# EAGLE design test (EAGLE 7.5.0)
ESKD_CHECKED: 209|224|244|232|243|235|235|232|237|32|205|46|210; ESKD_CONTROLN: 202|238|247|234|232|237|224|32|194|46|212; ESKD_COPYRIGHT: 211|240|212|211|44|32|200|208|200|210|45|208|210|212|44|32|208|199|45|54|48|48|52|48|55; ESKD_DATE1: 50|53|46|48|53|46|50|48|49|54; ESKD_DESCRIPTION1: 192|239|239|224|240|224|242|237|238|45|239|240|238|227|240|224|236|236|237|251|233|32|234|238|236|239|235|229|234|241|32|228|235|255|32|238|239|229|240|224|242|232|226|237|238|227|238|32|236|238|237|232|242|238|240|232|237|227|224|32|234|224|247|229|241|242|226|224|32|226|238|231|228|243|245|224|32|226|32|230|232|235|251|245|32|239|238|236|229|249|229|237|232|255|245; ESKD_DESCRIPTION2: 241|245|229|236|224|32|253|235|229|234|242|240|232|247|229|241|234|224|255; ESKD_DESCRIPTION3: 239|240|232|237|246|232|239|232|224|235|252|237|224|255; ESKD_ENGINEER: 208|238|227|238|230|232|237|32|194|46|200|46; ESKD_NUMBER: 50|51|48|50|48|49|32|48|48|48|32|48|48|48|32|55|49|55; ESKD_ORIENTATION: 48; ESKD_PAPER_SIZE: 49; ESKD_SHEETS: 49
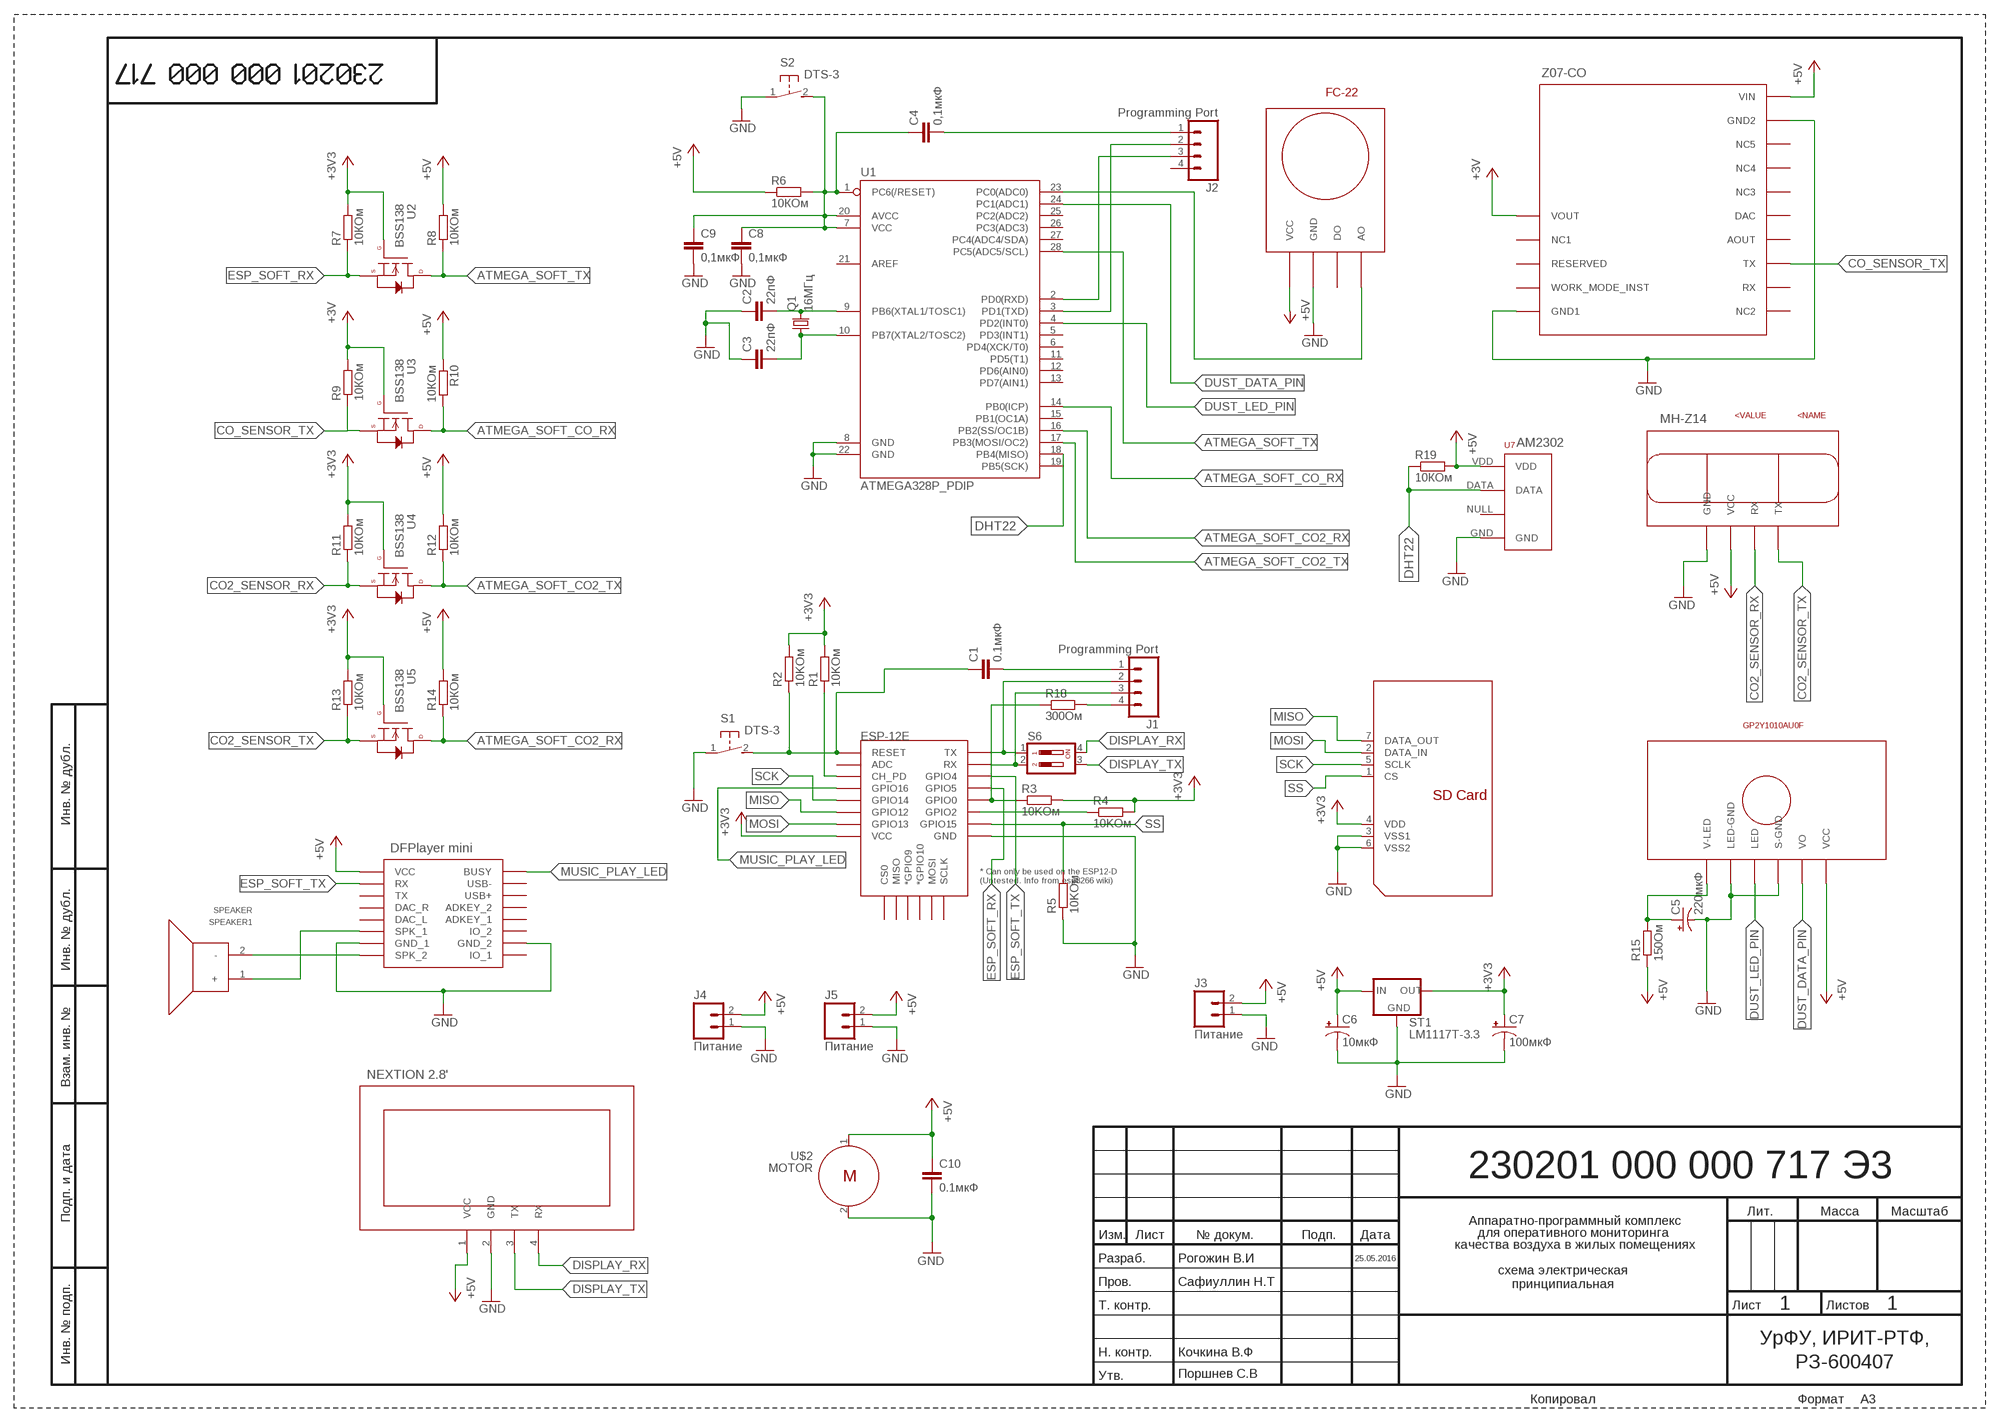
[diagram p0: schematic, sheet 1]

## Parts
C1  0.1мкФ  0.1UF-50V-20%(PTH)KIT-EZ  [CAP-PTH-SMALL-KIT]
C2  22пФ  0.1UF-50V-20%(PTH)KIT-EZ  [CAP-PTH-SMALL-KIT]
C3  22пФ  0.1UF-50V-20%(PTH)KIT-EZ  [CAP-PTH-SMALL-KIT]
C4  0,1мкФ  0.1UF-50V-20%(PTH)KIT-EZ  [CAP-PTH-SMALL-KIT]
C5  220мкФ  10UF-25V-20%(PTH)KIT  [CPOL-RADIAL-10UF-25V-KIT]
C6  10мкФ  10UF-25V-20%(PTH)KIT  [CPOL-RADIAL-10UF-25V-KIT]
C7  100мкФ  10UF-25V-20%(PTH)KIT  [CPOL-RADIAL-10UF-25V-KIT]
C8  0,1мкФ  0.1UF-50V-20%(PTH)KIT-EZ  [CAP-PTH-SMALL-KIT]
C9  0,1мкФ  0.1UF-50V-20%(PTH)KIT-EZ  [CAP-PTH-SMALL-KIT]
C10  0.1мкФ  0.1UF-50V-20%(PTH)KIT-EZ  [CAP-PTH-SMALL-KIT]
ESP-12E  ESP12ESMD  [ESP12E-SMD]
FC-22  FC-22FC-22-STANDART  [FC-22]
GP2Y1010AU0F  GP2Y1010AU0FGP2Y1010AU0F  [1X06]
J1  Programming Port  M04PTH  [1X04]
J2  Programming Port  M04PTH  [1X04]
J3  Питание  M02PTH  [1X02]
J4  Питание  M02PTH  [1X02]
J5  Питание  M02PTH  [1X02]
MH-Z14  MH-Z14  [1X04]
NEXTION1  NEXTION  [1X04]
Q1  16МГц  CRYSTALHC49S  [HC49/S]
R1  10KОм  R-EU_0207/10  [0207/10]
R2  10KОм  R-EU_0207/10  [0207/10]
R3  10KОм  R-EU_0207/10  [0207/10]
R4  10KОм  R-EU_0207/10  [0207/10]
R5  10KОм  R-EU_0207/10  [0207/10]
R6  10КОм  R-EU_0207/10  [0207/10]
R7  10КОм  R-EU_0207/10  [0207/10]
R8  10КОм  R-EU_0207/10  [0207/10]
R9  10КОм  R-EU_0207/10  [0207/10]
R10  10КОм  R-EU_0207/10  [0207/10]
R11  10КОм  R-EU_0207/10  [0207/10]
R12  10КОм  R-EU_0207/10  [0207/10]
R13  10КОм  R-EU_0207/10  [0207/10]
R14  10КОм  R-EU_0207/10  [0207/10]
R15  150Ом  R-EU_0207/10  [0207/10]
R18  300Ом  R-EU_0207/10  [0207/10]
R19  10КОм  R-EU_0207/10  [0207/10]
S1  DTS-3  [DTS-3]
S2  DTS-3  [DTS-3]
S6  DS02  [DS-02]
SDCARD-1  SDCARDSDSTAY  [SD]
SPEAKER1  SPEAKER  [1X02]
ST1  LM1117T-3.3  V_REG_LD1117VXX  [78XXL]
U1  ATMEGA328P_PDIP  [DIL28-3]
U2  BSS138  N-CHANNEL-MOSFET-BSS138  [SOT23-3]
U3  BSS138  N-CHANNEL-MOSFET-BSS138  [SOT23-3]
U4  BSS138  N-CHANNEL-MOSFET-BSS138  [SOT23-3]
U5  BSS138  N-CHANNEL-MOSFET-BSS138  [SOT23-3]
U7  RHT03_DHT-22_AM2302  [RHT03_DHT-22]
U$1  DFPLAYER  [DFPLAYER]
U$2  MOTOR  [1X02]
Z07-CO-1  ZE07-CO  [Z07-CO]

## Nets
+3V3: C7.1(+) ESP-12E.VCC R1.2 R2.2 R3.2 R4.2 R7.2 R11.2 R13.2 ST1.GND(OUT) U2.1(G) U4.1(G) U5.1(G)
+5V: C6.1(+) C10.1 FC-22.1(VCC) GP2Y1010AU0F.6(VCC) J3.2 J4.2 J5.2 MH-Z14.3(VCC) NEXTION1.1(VCC) R6.1 R8.2 R10.1 R12.2 R14.2 R15.1 R19.2 ST1.OUT(IN) U7.VDD U$1.VCC U$2.1 Z07-CO-1.15(VIN)
ATMEGA_SOFT_CO2_RX: R14.1 U1.16(PB2(SS/OC1B)) U5.3(D)
ATMEGA_SOFT_CO2_TX: R12.1 U1.17(PB3(MOSI/OC2)) U4.3(D)
ATMEGA_SOFT_CO_RX: R10.2 U1.14(PB0(ICP)) U3.3(D)
ATMEGA_SOFT_TX: R8.1 U1.28(PC5(ADC5/SCL)) U2.3(D)
CO2_SENSOR_RX: MH-Z14.2(RX) R11.1 U4.2(S)
CO2_SENSOR_TX: MH-Z14.1(TX) R13.1 U5.2(S)
CO_SENSOR_TX: R9.1 U3.2(S) Z07-CO-1.8(TX)
DHT22: R19.1 U1.18(PB4(MISO)) U7.DATA
DISPLAY_RX: NEXTION1.4(RX) S6.4
DISPLAY_TX: NEXTION1.3(TX) S6.3
DUST_DATA_PIN: GP2Y1010AU0F.5(VO) U1.24(PC1(ADC1))
DUST_LED_PIN: GP2Y1010AU0F.3(LED) U1.4(PD2(INT0))
ESP_SOFT_RX: ESP-12E.GPIO5 R7.1 U2.2(S)
ESP_SOFT_TX: ESP-12E.GPIO4 U$1.RX
GND: C2.1 C3.1 C5.2(-) C6.2(-) C7.2(-) C8.2 C9.2 C10.2 ESP-12E.GND FC-22.2(GND) GP2Y1010AU0F.2(LED-GND) GP2Y1010AU0F.4(S-GND) J3.1 J4.1 J5.1 MH-Z14.4(GND) NEXTION1.2(GND) R5.1 S1.1 S2.1 ST1.IN(GND) U1.8(GND) U1.22(GND) U7.GND U$1.GND_1 U$1.GND_2 U$2.2 Z07-CO-1.5(GND1) Z07-CO-1.14(GND2)
MISO: ESP-12E.GPIO12 SDCARD-1.7(DATA_OUT)
MOSI: ESP-12E.GPIO13 SDCARD-1.2(DATA_IN)
MUSIC_PLAY_LED: ESP-12E.GPIO16 U$1.BUSY
N$1: C5.1(+) GP2Y1010AU0F.1(V-LED) R15.2
N$2: C4.1 C8.1 C9.1 R6.2 S2.2 U1.1(PC6(/RESET)) U1.7(VCC) U1.20(AVCC)
N$3: ESP-12E.CH_PD R1.1
N$4: ESP-12E.GPIO0 R3.1 R18.1
N$5: ESP-12E.GPIO2 R4.1
N$6: ESP-12E.RXD0(RX) J1.3 S6.2
N$7: C1.1 ESP-12E.RESET R2.1 S1.2
N$8: C1.2 J1.1
N$9: ESP-12E.TXD0(TX) J1.2 S6.1
N$10: C3.2 Q1.1 U1.10(PB7(XTAL2/TOSC2))
N$11: SPEAKER1.1(+) U$1.SPK1(SPK_1)
N$12: SPEAKER1.2(-) U$1.SPK2(SPK_2)
N$13: C2.2 Q1.2 U1.9(PB6(XTAL1/TOSC1))
N$14: C4.2 J2.1
N$15: J2.2 U1.3(PD1(TXD))
N$16: J1.4 R18.2
N$17: J2.3 U1.2(PD0(RXD))
N$18: FC-22.4(AO) U1.23(PC0(ADC0))
SCK: ESP-12E.GPIO14 SDCARD-1.5(SCLK)
SS: ESP-12E.GPIO15 R5.2 SDCARD-1.1(CS)
VCC: R9.2 U3.1(G) Z07-CO-1.1(VOUT) ; supply symbol labelled +3V
VDD: SDCARD-1.4(VDD) ; supply symbol labelled +3V3
VSS2: SDCARD-1.3(VSS1) SDCARD-1.6(VSS2) ; supply symbol labelled GND
Unconnected: ESP-12E.ADC ESP-12E.CS0 ESP-12E.GPIO9(*GPIO9) ESP-12E.GPIO10(*GPIO10) ESP-12E.MISO ESP-12E.MOSI ESP-12E.SCLK FC-22.3(DO) J2.4 U1.5(PD3(INT1)) U1.6(PD4(XCK/T0)) U1.11(PD5(T1)) U1.12(PD6(AIN0)) U1.13(PD7(AIN1)) U1.15(PB1(OC1A)) U1.19(PB5(SCK)) U1.21(AREF) U1.25(PC2(ADC2)) U1.26(PC3(ADC3)) U1.27(PC4(ADC4/SDA)) U7.NULL U$1.ADKEY1(ADKEY_1) U$1.ADKEY2(ADKEY_2) U$1.DAC_L U$1.DAC_R U$1.IO1(IO_1) U$1.IO2(IO_2) U$1.TX U$1.USB+ U$1.USB- Z07-CO-1.2(NC1) Z07-CO-1.3(RESERVED) Z07-CO-1.4(WORK_MODE_INST) Z07-CO-1.6(NC2) Z07-CO-1.7(RX) Z07-CO-1.9(AOUT) Z07-CO-1.10(DAC) Z07-CO-1.11(NC3) Z07-CO-1.12(NC4) Z07-CO-1.13(NC5)

## Notes on the sheet
- Z07-CO
- MH-Z14
- AM2302
- Инв. № дубл.
- DFPlayer mini
- Инв. № дубл.
- Взам. инв. №
- NEXTION 2.8'
- 230201 000 000 717 Э3
- Подп. и дата
- Лит. | Масса | Масштаб
- Аппаратно-программный комплекс
- для оперативного мониторинга
- Изм. | Лиcт | № докум. | Подп. | Дата
- качества воздуха в жилых помещениях
- 25.05.2016
- Разраб. | Рогожин В.И
- схема электрическая
- Пров. | Сафиуллин Н.Т | принципиальная
- Т. контр. | Лиcт | 1 | Листов | 1
- Инв. № подп.
- УрФУ, ИРИТ-РТФ,
- Н. контр. | Кочкина В.Ф
- РЗ-600407
- Утв. | Поршнев С.В
- Копировал | Формат | A3

## Library data of the parts
C1-C4 C8-C10 = SparkFun-Capacitors:0.1UF-50V-20%(PTH): CAP-08370; PROD_ID: CAP-08370
C5-C7 = SparkFun-Capacitors:10UF-25V-20%(PTH): CAP-08440; PROD_ID: CAP-08440
ESP-12E = esp8266modules:ESP12E: ESP12E Module
FC-22 = diplom:FC-22
GP2Y1010AU0F = diplom:GP2Y1010AU0F
J1 J2 = SparkFun-Connectors:M04: Header 4 Standard 4-pin 0.1" header. Use with straight break away headers (SKU : PRT-00116), right angle break away headers (PRT-00553), swiss pins (PRT-00743), machine pins (PRT-00117), and female headers (PRT-00115). Molex polarized connector foot print use with SKU : PRT-08231 with associated crimp pins and housings. 1MM SMD Version SKU: PRT-10208; PROD_ID: CONN-09696
J3-J5 = SparkFun-Connectors:M02: Standard 2-pin 0.1" header. Use with - straight break away headers ( PRT-00116) - right angle break away headers (PRT-00553) - swiss pins (PRT-00743) - machine pins (PRT-00117) - female headers (PRT-00115) Molex polarized connector foot print use with: PRT-08233 with associated crimp pins and housings. 2.54_SCREWTERM for use with PRT-10571. 3.5mm Screw Terminal footprints for PRT-08084 5mm Screw Terminal footprints for use with PRT-08432
MH-Z14 = diplom:MH-Z14
NEXTION1 = diplom:NEXTION
Q1 = crystal:CRYSTAL: CRYSTAL; OC_FARNELL: 1667008; OC_NEWARK: unknown
R1-R15 R18 R19 = rcl:R-EU_: RESISTOR, European symbol
S1 S2 = switch-tact:DTS-3
S6 = switch-dil:DS02: DIL/CODE SWITCH; OC_FARNELL: 9472126; OC_NEWARK: unknown
SDCARD-1 = diplom:SDCARD
SPEAKER1 = diplom:SPEAKER
ST1 = SparkFun-PowerIC:V_REG_LD1117VXX: LD1117VXX voltage regulator. We carry the 3.3V version (COM-00526) in TO-220 package.
U1 = SparkFun-DigitalIC:ATMEGA328P_PDIP: uC used in the Arduino 32kb flash, 1k EEPROM, 2k SRAM This is the through-hole version of this chip.
U2-U5 = GeekAmmo:N-CHANNEL-MOSFET: N-Channel MOSFET Mode Field Effect Transistor; DATASHEET: http://www.fairchildsemi.com/ds/BS/BSS138.pdf; DIGIKEY: BSS138TR-ND; ELEMENT14: 2323154; URL: http://au.element14.com/fairchild-semiconductor/bss138/mosfet-n-ch-50v-220ma-sot-23/dp/2323154
U7 = RHT03_DHT-22_AM2302:RHT03_DHT-22_AM2302: RHT03 / DHT-22 / AM2302 Packages and symbol for the RHT03 / DHT-22 relative humidity and temperature sensor. Note: The AM2302 is a wired version of the DHT-22 which typically requires less clearance and is thus provided as a separate package.; PROD_ID: SEN-10167
U$1 = DFPlayer_v1:DFPLAYER
U$2 = diplom:MOTOR
Z07-CO-1 = diplom:ZE07-CO

## Board
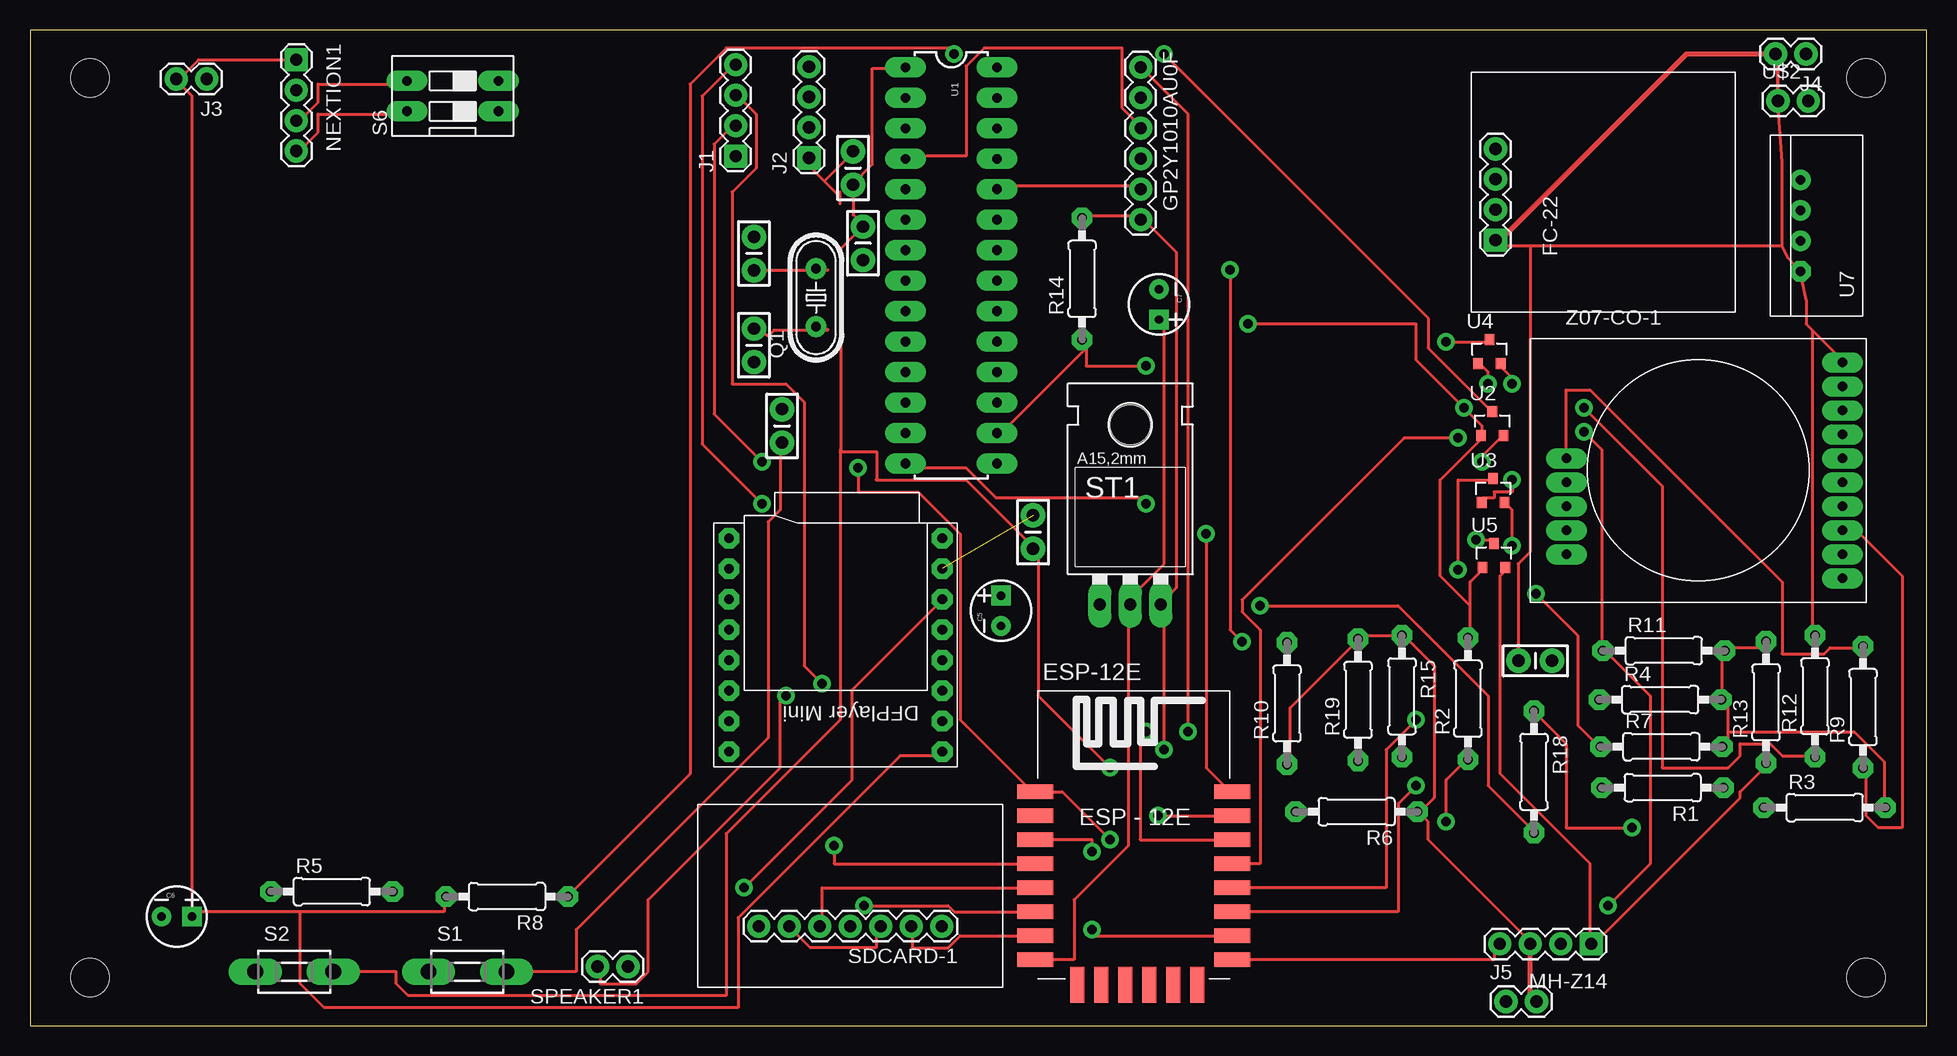
[diagram p1: board, top side]
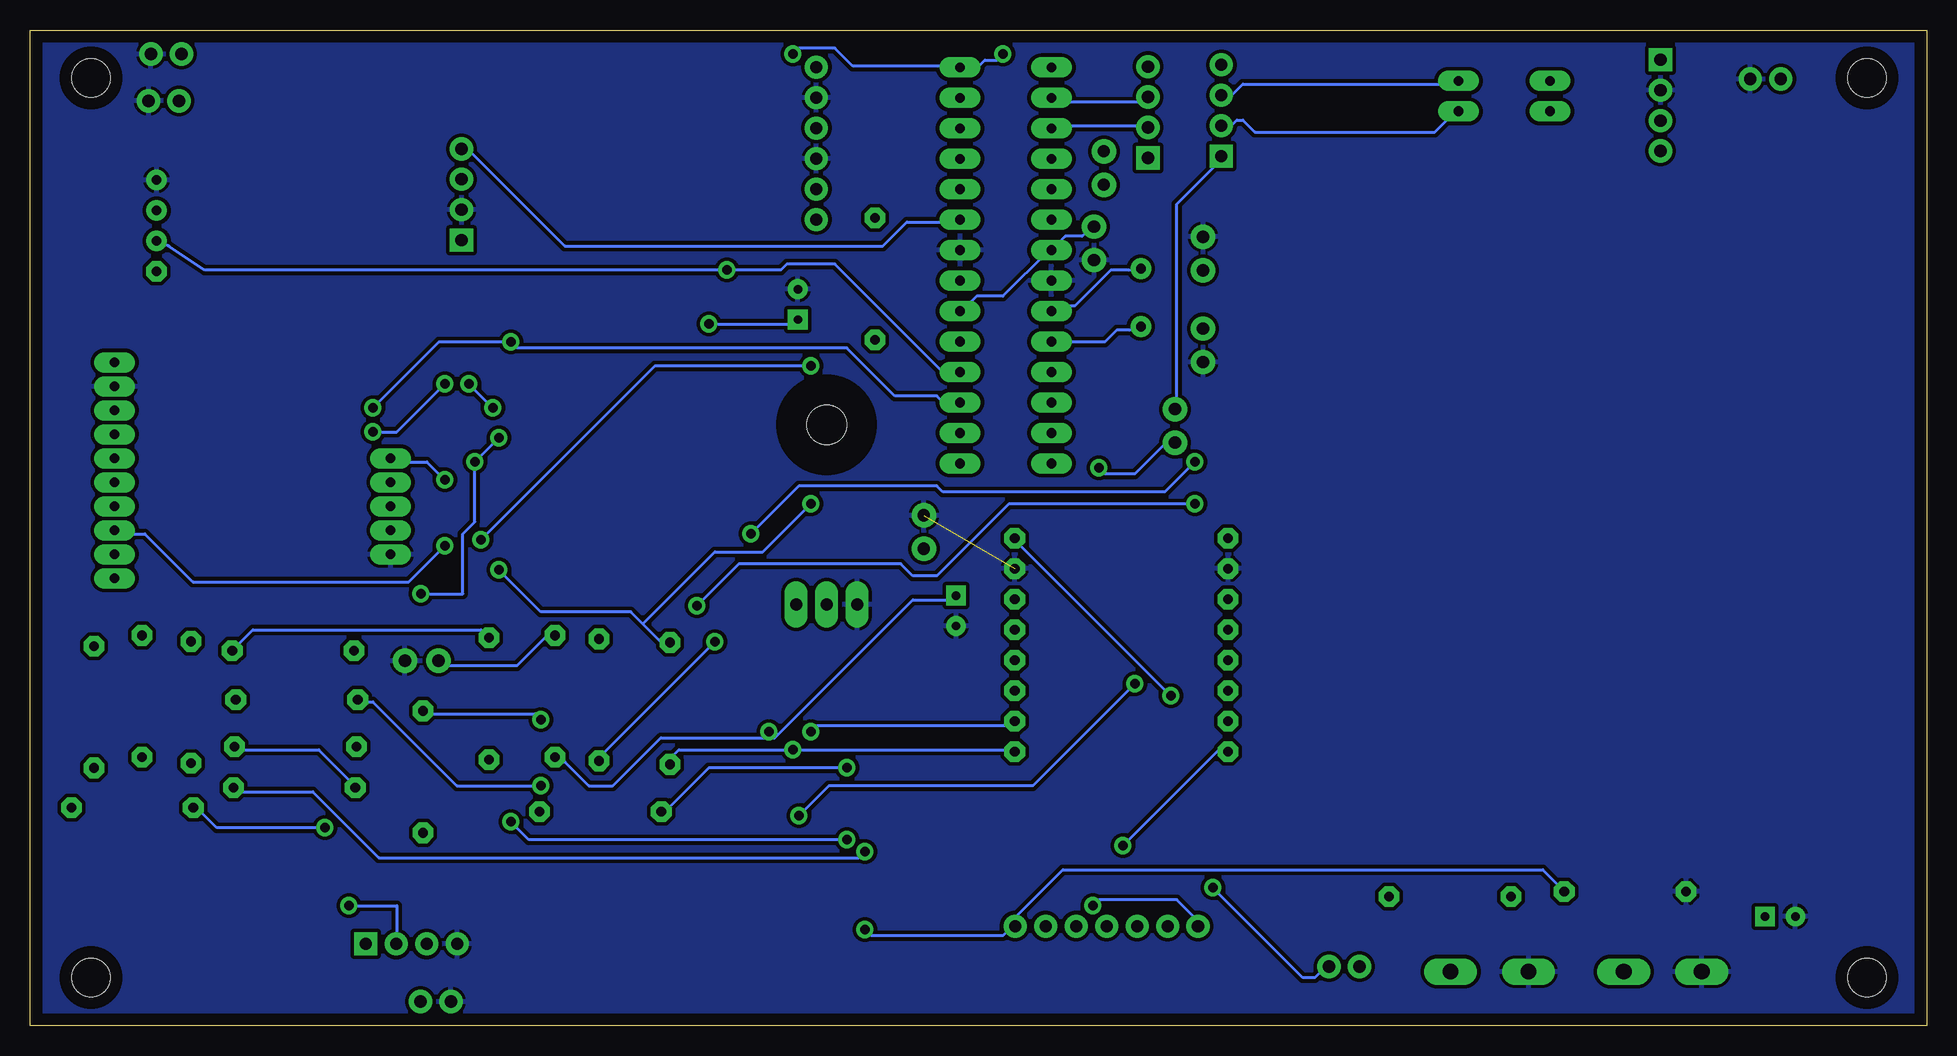
[diagram p2: board, bottom side, seen from below]

Size 158.08 x 83 mm. Coordinates in mm from the lower left corner, seen from the top.
Outline: 0,0 158.08,0 158.08,83 0,83 0,0
Copper layers (1*16): Top 0.035mm / dielectric 1.5mm / Bottom 0.035mm
Design rules "default": minimum track width 10mil, minimum drill 32mil, track to track 12mil, track to pad 12mil, pad to pad 12mil, via to via 12mil, smd to smd 8mil, copper to edge 40mil, drill to drill 30mil, minimum pad ring 18mil, minimum via ring 12mil, stop-mask expansion 4mil, vias tented up to drill 0mil, thermal gap 10mil
Holes 3.2 mm at 5,79 5,4 153,4 153,79

### Footprints (pad centres in the part's own frame; a part is rotated, then mirrored left to right if it is on the bottom)
CAP-PTH-SMALL-KIT = drill 1.016 pad 2.032: 1 -1.397,0; 2 1.397,0
CPOL-RADIAL-10UF-25V-KIT = drill 0.7 pad 1.651 square: 1 1.27,0 | drill 0.7 pad 1.651: 2 -1.27,0
ESP12E-SMD = smd 3 x 1.2: ADC -8.3,3.8; CH_PD -8.3,1.8; GND 8.1,-8.2; GPIO0 8.1,-2.2; GPIO2 8.1,-4.2; GPIO4 8.1,1.8; GPIO5 8.1,-0.2; GPIO12 -8.3,-4.2; GPIO13 -8.3,-6.2; GPIO14 -8.3,-2.2; GPIO15 8.1,-6.2; GPIO16 -8.3,-0.2; RESET -8.3,5.8; RXD0 8.1,3.8; TXD0 8.1,5.8; VCC -8.3,-8.2 | smd 1.2 x 3: CS0 -4.8,-10.3; GPIO9 -0.8,-10.3; GPIO10 1.2,-10.3; MISO -2.8,-10.3; MOSI 3.2,-10.3; SCLK 5.2,-10.3
FC-22 = drill 1.016 pad 1.88 square: 1 0,0 | drill 1.016 pad 1.88: 2 2.54,0; 3 5.08,0; 4 7.62,0
1X06 = drill 1.016 pad 1.88: 1 0,0; 2 2.54,0; 3 5.08,0; 4 7.62,0; 5 10.16,0; 6 12.7,0
1X04 = drill 1.016 pad 1.88 square: 1 0,0 | drill 1.016 pad 1.88: 2 2.54,0; 3 5.08,0; 4 7.62,0
1X02 = drill 1.016 pad 1.88: 1 0,0; 2 2.54,0
HC49/S = drill 0.813: 1 -2.413,0; 2 2.413,0
0207/10 = drill 0.813 octagon: 1 -5.08,0; 2 5.08,0
DTS-3 = drill 1.3 long: 1 -3.25,0; 2 3.25,0
DS-02 = drill 0.813 long: 1 -1.27,-3.81; 2 1.27,-3.81; 3 1.27,3.81; 4 -1.27,3.81
SD = drill 1.016 pad 1.88: 1 0,0; 2 2.54,0; 3 5.08,0; 4 7.62,0; 5 10.16,0; 6 12.7,0; 7 15.24,0
78XXL = drill 1.016 long: GND 0,-3.81; IN -2.54,-3.81; OUT 2.54,-3.81 | hole 3.302: 0,11.176
DIL28-3 = drill 0.813 long: 1 -16.51,-3.81; 2 -13.97,-3.81; 3 -11.43,-3.81; 4 -8.89,-3.81; 5 -6.35,-3.81; 6 -3.81,-3.81; 7 -1.27,-3.81; 8 1.27,-3.81; 9 3.81,-3.81; 10 6.35,-3.81; 11 8.89,-3.81; 12 11.43,-3.81; 13 13.97,-3.81; 14 16.51,-3.81; 15 16.51,3.81; 16 13.97,3.81; 17 11.43,3.81; 18 8.89,3.81; 19 6.35,3.81; 20 3.81,3.81; 21 1.27,3.81; 22 -1.27,3.81; 23 -3.81,3.81; 24 -6.35,3.81; 25 -8.89,3.81; 26 -11.43,3.81; 27 -13.97,3.81; 28 -16.51,3.81
SOT23-3 = smd 0.8 x 0.9: 1 -0.95,-1; 2 0.95,-1; 3 0,1
RHT03_DHT-22 = drill 0.8: DATA -1.27,0; GND 3.81,0; NULL 1.27,0 | drill 0.8 octagon: VDD -3.81,0
DFPLAYER = drill 0.8 pad 1.676 octagon: ADKEY1 8.89,-1.27; ADKEY2 8.89,1.27; BUSY 8.89,8.89; DAC_L -8.89,-1.27; DAC_R -8.89,1.27; GND_1 -8.89,-6.35; GND_2 8.89,-6.35; IO1 8.89,-8.89; IO2 8.89,-3.81; RX -8.89,6.35; SPK1 -8.89,-3.81; SPK2 -8.89,-8.89; TX -8.89,3.81; USB+ 8.89,3.81; USB- 8.89,6.35; VCC -8.89,8.89
Z07-CO = drill 0.8 pad 1.676 long: 1 -47,-22; 2 -47,-24; 3 -47,-26; 4 -47,-28; 5 -47,-30; 6 -24,-32; 7 -24,-30; 8 -24,-28; 9 -24,-26; 10 -24,-24; 11 -24,-22; 12 -24,-20; 13 -24,-18; 14 -24,-16; 15 -24,-14

### Placement (x,y rotation side)
C1  62.67,49.99 90 top
C2  60.33,64.36 270 top
C3  60.33,56.71 90 top
C4  68.59,71.49 90 top
C5  80.91,34.58 90 top
C6  12.23,9.09 0 top
C7  94.09,60.12 270 top
C8  83.59,41.14 90 top
C9  69.41,65.21 270 top
C10  125.44,30.41 0 top
ESP-12E  92.07,13.7 0 top
FC-22  122.12,65.47 90 top
GP2Y1010AU0F  92.55,79.9 270 top
J1  58.8,72.48 90 top
J2  64.91,72.33 90 top
J3  14.72,78.91 180 top
J4  148,81 180 top
J5  123,2 0 top
MH-Z14  130.1,6.8 180 top
NEXTION1  22.2,80.53 270 top
Q1  65.5,60.69 90 top
R1  136.05,19.83 180 top
R2  119.83,27.25 90 top
R3  149.55,18.17 0 top
R4  135.85,27.17 0 top
R5  25.15,11.17 0 top
R6  110.55,17.83 180 top
R7  135.95,23.25 0 top
R8  39.75,10.75 180 top
R9  152.75,26.55 90 top
R10  104.75,26.85 90 top
R11  136.15,31.25 0 top
R12  148.75,27.45 90 top
R13  144.67,26.95 90 top
R14  87.67,62.25 90 top
R15  114.33,27.45 270 top
R18  125.33,21.15 270 top
R19  110.67,27.15 90 top
S1  36.45,4.5 0 top
S2  22.02,4.5 0 top
S6  35.23,77.49 90 top
SDCARD-1  75.98,8.28 180 top
SPEAKER1  49.83,4.91 180 top
ST1  91.69,38.91 0 top
U1  76.77,63.37 270 top
U2  121.85,50.2 0 top
U3  121.93,44.6 0 top
U4  121.61,56.2 0 top
U5  121.99,39.2 0 top
U7  147.53,66.68 90 top
U$1  67.13,31.74 180 top
U$2  145.66,77.09 0 top
Z07-CO-1  175.03,69.29 0 top

### Tracks (layer width: path | path; a pad name or v marks a point on that pad's centre or on a via)
+3V3  (via drill 0.81)
  Top 0.254: ESP-12E.VCC 87,5.5 87,10.5 91.5,15 91.5,35 ST1.GND 92,35.5 92,36 94.5,38.5 94.5,58.5 C7.1 | 120,35 120,32.5 R2.2 | 120,35 120,37 121,38 U5.1 | 120,35 117.5,37.5 117.5,45.5 121,49 U2.1 121,49.5 121,50 v119.5,51.5 115.5,55.5 115.5,58.5 v101.5,58.5 | v121.5,53.5 121.5,54.5 121,55 U4.1 | R13.2 144.5,32 144.5,31.5 141.5,31.5 R11.2 141,31 141,27.5 R4.2 141,27 141.5,26.5 141.5,24.5 | 141.5,24.5 152,24.5 154.5,22 154.5,18.5 R3.2 | 141.5,24.5 141.5,23.5 R7.2
  Bottom 0.254: v119.5,51.5 v121.5,53.5 | R1.2 131,20 134,23 141,23 R7.2 | R2.2 120.5,33 139.5,33 141,31.5 R11.2 | v101.5,58.5 94.5,58.5 C7.1
+5V  (via drill 0.81)
  Top 0.254: NEXTION1.1 22,80.5 14,80.5 12.5,79 J3.2 12.5,78.5 13.5,77.5 13.5,9.5 | 22.5,9.5 34.5,9.5 34.5,10.5 R8.2 | 22.5,9.5 13.5,9.5 | 13.5,9.5 C6.1 | 148.5,58 148,58.5 148,60.5 U7.VDD 146.5,64 146,65 | 148.5,58 151,55.5 Z07-CO-1.15 | 148.5,58 148.5,33 R12.2 | 146,65 125,65 | 125,65 122.5,65 FC-22.1 | 146,65 146,72 U$2.1 | 125,65 125,39.5 124,38.5 124,30.5 C10.1 | R14.2 88,67.5 92.5,67.5 GP2Y1010AU0F.6 93,67 95.5,64.5 95.5,36.5 94.5,35.5 ST1.OUT 94.5,35 v94.5,23 | MH-Z14.3 125,7 116.5,15.5 116.5,17 116,17.5 R6.1 116,18 117,19 117,30 114.5,32.5 R15.1 114,32.5 111,32.5 R19.2 110.5,32 105,26.5 105,22 R10.1 | 22.5,9.5 22.5,3.5 24.5,1.5 59,1.5 59,9 72.5,22.5 76,22.5 U$1.VCC
  Top 0.305: J4.2 145.66,81 U$2.1
  Top 0.406: J5.2 125.02,2 MH-Z14.3
  Bottom 0.254: U$1.VCC 76.5,23 v94.5,23 104,23 105,22 R10.1 | C10.1 124,30 117.5,30 115,32.5 114.5,32.5 R15.1
ATMEGA_SOFT_CO2_RX  (via drill 0.81)
  Top 0.254: v120.5,40.5 122,40.5 U5.3 | v93,55 88,55 88,56.5 | 88,56.5 88,57 R14.1 88,56.5 | 88,56.5 81,49.5 U1.16
  Bottom 0.254: v120.5,40.5 106,55 v93,55
ATMEGA_SOFT_CO2_TX  (via drill 0.81)
  Top 0.254: v118,57 121.5,57 U4.3 | v129.5,51.5 136,45 136,21.5 141.5,21.5 142.5,22.5 142.5,23.5 145,23.5 146,22.5 148.5,22.5 R12.1
  Bottom 0.254: U1.17 81,52 82,52 82.5,52.5 86,52.5 90,56.5 117.5,56.5 v118,57 124,57 v129.5,51.5
ATMEGA_SOFT_CO_RX  (via drill 0.81)
  Top 0.254: v119,38 119,45.5 122,45.5 U3.3 | v93,43.5 93,44 80.5,44 78,46.5 73,46.5 U1.14
  Bottom 0.254: v119,38 115.5,34.5 108,34.5 107,33.5 | 107,33.5 105.5,32 105,32 R10.2 | v93,43.5 97,39.5 101,39.5 107,33.5
ATMEGA_SOFT_TX  (via drill 0.81)
  Top 0.254: v94.5,81 116.5,59 116.5,56.5 121.5,51.5 U2.3 | v77,81 77,81.5 58,81.5 55,78.5 55,21 45,11 R8.1
  Bottom 0.254: v94.5,81 94,81.5 91,81.5 89.5,80 81,80 U1.28 80.5,80 79,80 78.5,80.5 77.5,80.5 v77,81
CO2_SENSOR_RX  (via drill 0.81)
  Top 0.254: v123.5,53.5 123.5,54 122.5,55 U4.2 | v129.5,49.5 131,48 131,31.5 R11.1 131.5,31 135,27.5 135,13.5 v131.5,10
  Bottom 0.254: v123.5,53.5 127.5,49.5 v129.5,49.5 | v131.5,10 127.5,10 127.5,7 MH-Z14.2
CO2_SENSOR_TX
  Top 0.254: U5.2 123,38 122.5,37.5 122.5,21 130,13.5 130,7 MH-Z14.1 130.5,7 142.5,19 142.5,19.5 144.5,21.5 R13.1
CO_SENSOR_TX  (via drill 0.81)
  Top 0.254: v123.5,40 123.5,43 123,43.5 U3.2 | R9.1 153,21 153,17.5 154,16.5 156,16.5 156,37.5 152.5,41 151.5,41 Z07-CO-1.8
  Bottom 0.254: v123.5,40 126.5,37 144.5,37 148.5,41 151,41 Z07-CO-1.8
DHT22  (via drill 0.81)
  Top 0.254: v101,32 100,33 v100,63
  Bottom 0.254: U7.DATA 146.5,65 143.5,63 v100,63 95.5,63 95,63.5 91,63.5 82,54.5 81,54.5 U1.18 | v101,32 110.5,22.5 R19.1
DISPLAY_RX
  Top 0.254: S6.4 31,76 24,76 24,74.5 22.5,73 NEXTION1.4
DISPLAY_TX
  Top 0.254: S6.3 31,78.5 24,78.5 24,77 22.5,75.5 NEXTION1.3
DUST_DATA_PIN
  Top 0.254: U1.24 81,70 92.5,70 GP2Y1010AU0F.5
DUST_LED_PIN
  Top 0.254: U1.4 73,72.5 78,72.5 78,80 79.5,81.5 91,81.5 91,76.5 92.5,75 GP2Y1010AU0F.3
ESP_SOFT_RX  (via drill 0.81)
  Top 0.254: v121,47 121,47.5 122.5,49 U2.2 | v125.5,36 129,32.5 129,25 130.5,23.5 R7.1 | ESP-12E.GPIO5 102.5,13.5 102.5,33 101,34.5 101,35.5 114.5,49 v119,49
  Bottom 0.254: v125.5,36 122,36 122,41 121,42 v121,47 v119,49
ESP_SOFT_TX  (via drill 0.81)
  Top 0.254: ESP-12E.GPIO4 92.5,15.5 92.5,24 v93,24.5
  Bottom 0.254: v93,24.5 92.5,25 76.5,25 U$1.RX
GND  (1 unrouted)
  Top 0.254: ESP-12E.GND 122,5.5 122,6.5 MH-Z14.4
  pour Bottom: 0,0 158,0 158,83 0,83
MISO  (via drill 0.81)
  Top 0.254: ESP-12E.GPIO12 77,9.5 76.5,10 v69.5,10
  Bottom 0.254: v69.5,10 69,10.5 62.5,10.5 60.5,8.5 SDCARD-1.7
MOSI
  Top 0.254: ESP-12E.GPIO13 77.5,7.5 76.5,6.5 73.5,6.5 73.5,8 SDCARD-1.2
MUSIC_PLAY_LED  (via drill 0.81)
  Top 0.254: ESP-12E.GPIO16 67,13.5 v67,15
  Bottom 0.254: v67,15 59,23 58.5,23 U$1.BUSY
N$1  (via drill 0.81)
  Top 0.254: v96.5,24.5 96.5,76 93,79.5 GP2Y1010AU0F.1
  Bottom 0.254: 96.5,24 105.5,24 109.5,20 111.5,20 113.5,22 114,22 R15.2 | 96.5,24 96,24 84.5,35.5 81,35.5 C5.1 | 96.5,24 v96.5,24.5
N$2  (via drill 0.81)
  Top 0.254: v90,21.5 84,27.5 84,39.5 C8.1 83.5,40 78,45.5 70.6,45.5 | 80.5,60 U1.20 | 73,65 U1.7 | S2.2 30.5,4.5 30.5,3.5 31.5,2.5 58,2.5 58,16 67.5,25.5 67.5,47.8 | 67.5,47.8 67.5,48 67.6,48 67.6,64.8 C9.1 69.4,66.8 68.6,67.6 68.6,70 C4.1 68.6,70.2 70.2,71.8 70.2,79.8 72.8,79.8 U1.1 | 70.5,45.5 70.6,45.5 | 67.5,47.8 70.6,47.8 70.6,45.5
  Bottom 0.254: v90,21.5 101.5,21.5 105,18 R6.2 | C9.1 69.6,66.6 70.4,65.8 71.8,65.8 U1.7 73,64.6 73.2,64.6 77,60.8 79.2,60.8 80.4,59.6 U1.20
N$3  (via drill 0.81)
  Top 0.254: ESP-12E.CH_PD 88.5,15.5 v88.5,14.5
  Bottom 0.254: v88.5,14.5 89,14 129,14 134.5,19.5 141,19.5 R1.1
N$4  (via drill 0.81)
  Top 0.254: ESP-12E.GPIO0 113,11.5 113,23 v115.5,25.5 | v133.5,16.5 128,16.5 128,23.5 125.5,26 R18.1
  Bottom 0.254: v115.5,25.5 116,26 125,26 R18.1 | v133.5,16.5 142.5,16.5 144,18 R3.1
N$5  (via drill 0.81)
  Top 0.254: ESP-12E.GPIO2 114,9.5 114,18.5 v115.5,20
  Bottom 0.254: v115.5,20 122.5,20 129.5,27 130.5,27 R4.1
N$6  (via drill 0.81)
  Top 0.254: v94,17.5 ESP-12E.RXD0 | v66,28.5 64.5,30 64.5,52 63,53.5 58.5,53.5 58.5,69.5 60.5,71.5 60.5,76 59,77.5 J1.3
  Bottom 0.254: v94,17.5 91.5,20 74.5,20 v66,28.5 | S6.2 39.5,78.5 57,78.5 58,77.5 58.5,77.5 J1.3
N$7  (via drill 0.81)
  Top 0.254: v69,46.5 69,44.5 74,44.5 77.5,41 77.5,25.5 83.5,19.5 ESP-12E.RESET 86,19.5 v90,15.5 | v118,17 118,20.5 119.5,22 R2.1 | S1.2 45.5,4.5 45.5,8 61.5,24 61.5,42 62.5,43 62.5,48.5 C1.1
  Bottom 0.254: v69,46.5 68.5,46 66,46 63.5,48.5 63,48.5 C1.1 | v118,17 116.5,15.5 v90,15.5
N$8
  Bottom 0.254: J1.1 59,72 62.5,68.5 62.5,51.5 C1.2
N$9  (via drill 0.81)
  Top 0.254: v98,41 98,21.5 100,19.5 ESP-12E.TXD0 | v61,47 57,51 57,73.5 58.5,75 J1.2
  Bottom 0.254: v98,41 94,45 82.5,45 82,44.5 63.5,44.5 v61,47 | S6.1 39.5,76 41,74.5 56,74.5 57,75.5 57.5,75.5 58,75 58.5,75 J1.2
N$10
  Top 0.254: Q1.1 66.5,58 62,58 61.5,57.5 C3.2
  Bottom 0.254: U1.10 72.5,57 68.5,57 67.5,58 66.5,58 Q1.1
N$11  (via drill 0.81)
  Top 0.254: v59.5,11.5 68.5,20.5 68.5,28 76,35.5 U$1.SPK1
  Bottom 0.254: v59.5,11.5 52,4 51,4 50.5,4.5 50,4.5 SPEAKER1.1
N$12  (via drill 0.81)
  Top 0.254: v63,27.5 62.5,27 62.5,21.5 51.5,10.5 51.5,4.5 50.5,3.5 47.5,3.5 47.5,4.5 SPEAKER1.2
  Bottom 0.254: v63,27.5 76,40.5 U$1.SPK2
N$13
  Top 0.254: Q1.2 66.5,63 60.5,63 C2.2
  Bottom 0.254: U1.9 72.5,60 71,60 68,63 66.5,63 Q1.2
N$14
  Top 0.254: 67.5,68.5 67.5,69.2 | 67.5,69.2 67.5,69.5 | 66.2,70.4 65,71.6 65,72 J2.1 | 66.2,70.4 67.4,69.2 67.5,69.2 | 66.2,70.4 68.4,72.6 68.4,72.8 C4.2
N$15
  Bottom 0.254: U1.3 72.5,75 65,75 J2.2
N$16  (via drill 0.81)
  Top 0.254: v102.5,35 114,35 121.5,27.5 121.5,20 125,16.5 R18.2 | v61,43.5 56,48.5 56,77.5 58.5,80 J1.4
  Bottom 0.254: v102.5,35 99,38.5 85.5,38.5 84.5,37.5 82.5,37.5 76.5,43.5 v61,43.5
N$17
  Bottom 0.254: U1.2 72.5,77 65,77 J2.3
N$18
  Bottom 0.254: U1.23 81,67 85,67 87,65 113.5,65 121.5,73 122,73 FC-22.4
N$19
  Top 0.406: 145,81 138,81 122,65
SCK
  Top 0.254: ESP-12E.GPIO14 66,11.5 66,8.5 SDCARD-1.5
SS  (via drill 0.81)
  Top 0.254: ESP-12E.GPIO15 88.5,7.5 v88.5,8
  Bottom 0.254: v88.5,8 88,7.5 77,7.5 76.5,8 76,8 SDCARD-1.1 76,8.5 76,9 72,13 32,13 30.5,11.5 R5.2
VCC  (via drill 0.81)
  Top 0.254: v123.5,45.5 123.5,44.5 122,44.5 122,44 121,44 U3.1 | R9.2 152.5,31.5 150,31.5 149.5,31 146,31 146,37 130,53 128,53 128,47.5 Z07-CO-1.1
  Bottom 0.254: v123.5,45.5 125,47 128,47 Z07-CO-1.1
VSS2
  Top 0.254: SDCARD-1.6 63.5,8 65,6.5 70.5,6.5 70.5,8 SDCARD-1.3